# EAGLE schematic powerdistribution (EAGLE 7.5.0)
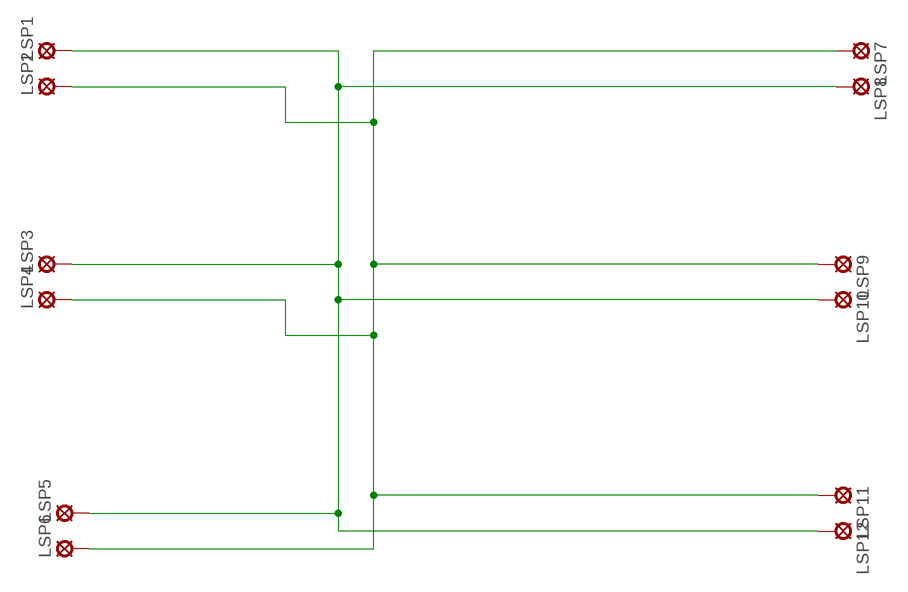
[diagram p0: schematic, sheet 1]

## Parts
LSP1  SE11  [SE11]
LSP2  SE11  [SE11]
LSP3  SE11  [SE11]
LSP4  SE11  [SE11]
LSP5  SE11  [SE11]
LSP6  SE11  [SE11]
LSP7  SE11  [SE11]
LSP8  SE11  [SE11]
LSP9  SE11  [SE11]
LSP10  SE11  [SE11]
LSP11  SE11  [SE11]
LSP12  SE11  [SE11]

## Nets
N$1: LSP1.MP LSP3.MP LSP5.MP LSP8.MP LSP10.MP LSP12.MP
N$2: LSP2.MP LSP4.MP LSP6.MP LSP7.MP LSP9.MP LSP11.MP

## Library data of the parts
LSP1-LSP12 = solpad:SE11: SOLDER PAD RTM, drill 1,1mm, distributor Buerklin, 07F810